# EAGLE schematic 1206LED-breakout (EAGLE 9.2.0)
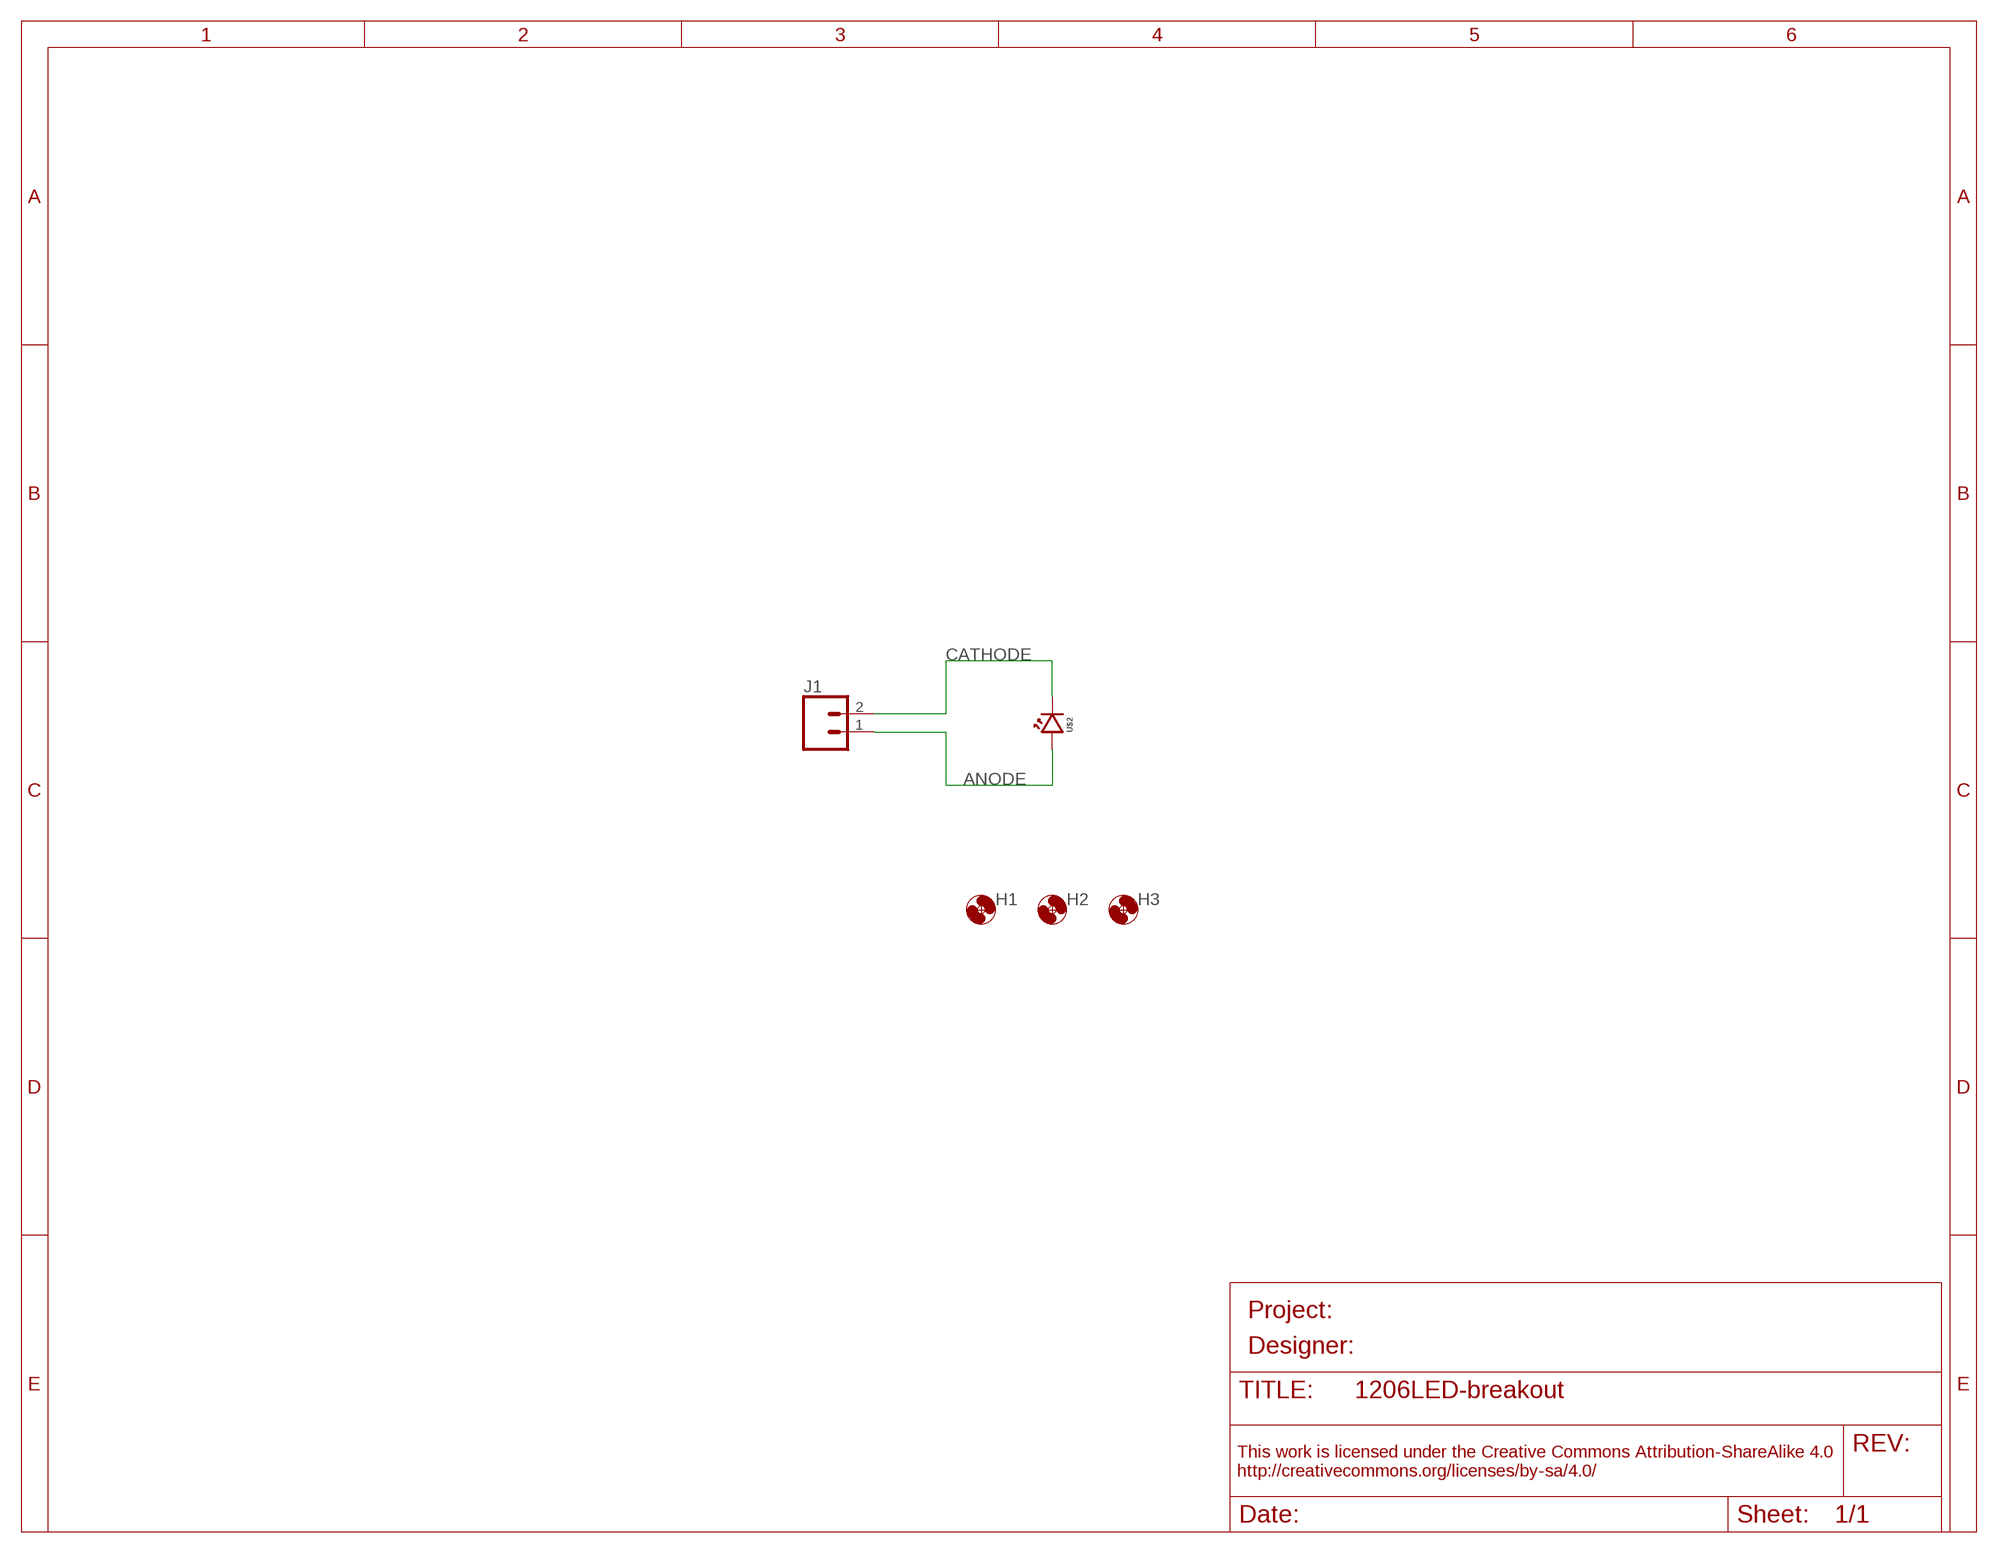
[diagram p0: schematic, sheet 1]

## Parts
H1  MOUNTING_HOLE2_NP  [2_56]
H2  MOUNTING_HOLE2_NP  [2_56]
H3  MOUNTING_HOLE2_NP  [2_56]
J1  CONN_021X02_NO_SILK  [1X02_NO_SILK]
U$2  1206-LED  [1206-LED]

## Nets
ANODE: J1.1 U$2.ANODE
CATHODE: J1.2 U$2.CATHODE

## Library data of the parts
H1-H3 = bschulz:MOUNTING_HOLE: Genaric Mechanical Mounting Hole Hole diameter based on max body diameter + 15% Keepout ring is for diameter of socket cap screw (minimum required clearance) TPlace ring is for diameter of pan head screw (recomended clearance) Specifications: Socket Cap <http://fastener-express.com/fastener-technical/SocketscapSS-Alloy.pdf> Button Head Socket Cap <http://fastener-express.com/fastener-technical/Button-Socket-alloy.pdf> Pan Head <http://fastener-express.com/fastener-technical/pan-machine-Screws.pdf>
J1 = bschulz:CONN_02: Multi connection point. Often used as Generic Header-pin footprint for 0.1 inch spaced/style header connections On any of the 0.1 inch spaced packages, you can populate with these: Break Away Headers - Straight <https://www.sparkfun.com/products/116> (PRT-00116) Break Away Male Headers - Right Angle <https://www.sparkfun.com/products/553> (PRT-00553) Female Headers <https://www.sparkfun.com/products/115> (PRT-00115) Break Away Headers - Machine Pin <https://www.sparkfun.com/products/117> (PRT-00117) Break Away Female Headers - Swiss Machine Pin <https://www.sparkfun.com/products/743> (PRT-00743) For SCREWTERMINALS and SPRING TERMINALS visit here: Screw Terimnals on SparkFun.com <https://www.sparkfun.com/search/results?term=Screw+Terminals> (5mm/3.5mm/2.54mm spacing) This device is also useful as a general connection point to wire up your design to another part of your project. Our various solder wires solder well into these plated through hole pads. Hook-Up Wire - Assortment (Stranded, 22 AWG) <https://www.sparkfun.com/products/11375> (PRT-11375) Hook-Up Wire - Assortment (Solid Core, 22 AWG) <https://www.sparkfun.com/products/11367> (PRT-11367) View the entire wire category on our website here <https://www.sparkfun.com/categories/141> Special notes: Molex polarized connector foot print use with: PRT-08233 with associated crimp pins and housings. 2.54_SCREWTERM for use with PRT-10571. 3.5mm Screw Terminal footprints for PRT-08084 5mm Screw Terminal footprints for use with PRT-08432
U$2 = bschulz:1206-LED